# EAGLE design left_revision0_6 (EAGLE 7.2.0)
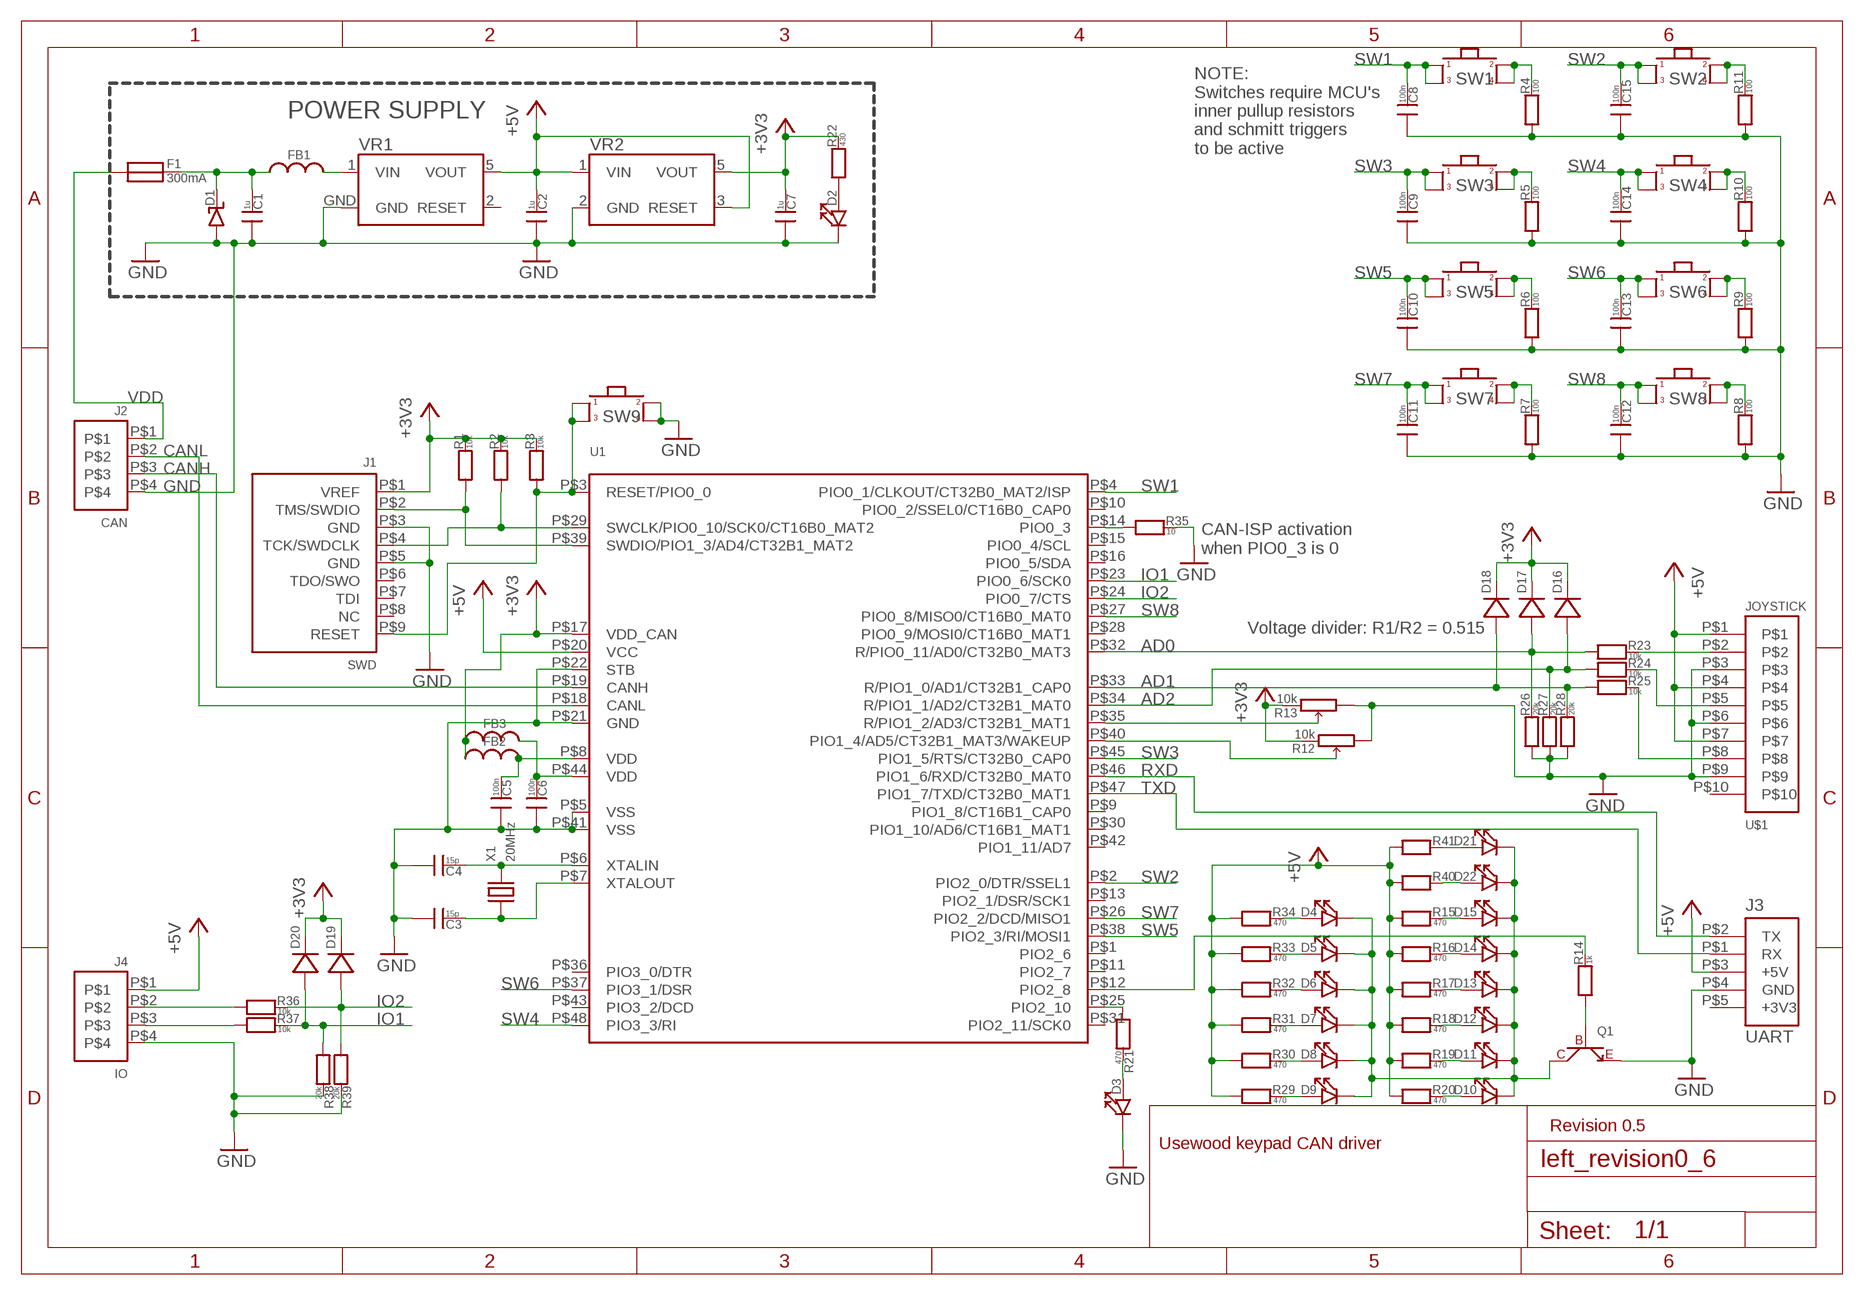
[diagram p0: schematic, sheet 1]

## Parts
C1  1u  CAP0603  [0603]
C2  1u  CAP0603  [0603]
C3  15p  CAP0603  [0603]
C4  15p  CAP0603  [0603]
C5  100n  CAP0603  [0603]
C6  100n  CAP0603  [0603]
C7  1u  CAP0603  [0603]
C8  100n  CAP0603  [0603]
C9  100n  CAP0603  [0603]
C10  100n  CAP0603  [0603]
C11  100n  CAP0603  [0603]
C12  100n  CAP0603  [0603]
C13  100n  CAP0603  [0603]
C14  100n  CAP0603  [0603]
C15  100n  CAP0603  [0603]
D1  DIODE_TVSDO-214AA  [DO-214AB]
D2  LED0603  [0603]
D3  LED0603  [0603]
D4  LED0603  [0603]
D5  LED0603  [0603]
D6  LED0603  [0603]
D7  LED0603  [0603]
D8  LED0603  [0603]
D9  LED0603  [0603]
D10  LED0603  [0603]
D11  LED0603  [0603]
D12  LED0603  [0603]
D13  LED0603  [0603]
D14  LED0603  [0603]
D15  LED0603  [0603]
D16  DIODEDO219AB  [DO219AB]
D17  DIODEDO219AB  [DO219AB]
D18  DIODEDO219AB  [DO219AB]
D19  DIODEDO219AB  [DO219AB]
D20  DIODEDO219AB  [DO219AB]
D21  LED0603  [0603]
D22  LED0603  [0603]
F1  300mA  FUSE100MA  [FUSE_100MA]
FB1  FERRITE0603  [0603]
FB2  FERRITE0603  [0603]
FB3  FERRITE0603  [0603]
J1  SWD  ARM_JTAG/SWD_HEADER_10_PINSMD  [ARM_10_PIN_JTAG/SWD_CONNECTOR]
J2  CAN  MOLEX_MICRO-FIT_4WAYTH  [MOLEX_MICRO-FIT_4WAY]
J3  UART  HEADER_USARTTH  [HEADER5_1]
J4  IO  MOLEX_MICRO-FIT_4WAYTH  [MOLEX_MICRO-FIT_4WAY]
Q1  NPN_TRANSISTORSOT323  [SOT323]
R1  10k  RES0603  [0603]
R2  10k  RES0603  [0603]
R3  10k  RES0603  [0603]
R4  100  RES0603  [0603]
R5  100  RES0603  [0603]
R6  100  RES0603  [0603]
R7  100  RES0603  [0603]
R8  100  RES0603  [0603]
R9  100  RES0603  [0603]
R10  100  RES0603  [0603]
R11  100  RES0603  [0603]
R12  10k  RES_POTRK09K1130C94  [RES_POT_RK09K1130C94]
R13  10k  RES_POTRK09K1130C94  [RES_POT_RK09K1130C94]
R14  1k  RES0603  [0603]
R15  470  RES0603  [0603]
R16  470  RES0603  [0603]
R17  470  RES0603  [0603]
R18  470  RES0603  [0603]
R19  470  RES0603  [0603]
R20  470  RES0603  [0603]
R21  470  RES0603  [0603]
R22  430  RES0603  [0603]
R23  10k  RES0603  [0603]
R24  10k  RES0603  [0603]
R25  10k  RES0603  [0603]
R26  20k  RES0603  [0603]
R27  20k  RES0603  [0603]
R28  20k  RES0603  [0603]
R29  470  RES0603  [0603]
R30  470  RES0603  [0603]
R31  470  RES0603  [0603]
R32  470  RES0603  [0603]
R33  470  RES0603  [0603]
R34  470  RES0603  [0603]
R35  10  RES0603  [0603]
R36  10k  RES0603  [0603]
R37  10k  RES0603  [0603]
R38  20k  RES0603  [0603]
R39  20k  RES0603  [0603]
R40  RES0603  [0603]
R41  RES0603  [0603]
SW1  SWITCH12X12MM_CENTER_HOLE  [SWITCH_12X12MM_CENTER_HOLE]
SW2  SWITCH12X12MM_CENTER_HOLE  [SWITCH_12X12MM_CENTER_HOLE]
SW3  SWITCH12X12MM_CENTER_HOLE  [SWITCH_12X12MM_CENTER_HOLE]
SW4  SWITCH12X12MM_CENTER_HOLE  [SWITCH_12X12MM_CENTER_HOLE]
SW5  SWITCH12X12MM_CENTER_HOLE  [SWITCH_12X12MM_CENTER_HOLE]
SW6  SWITCH12X12MM_CENTER_HOLE  [SWITCH_12X12MM_CENTER_HOLE]
SW7  SWITCH12X12MM_CENTER_HOLE  [SWITCH_12X12MM_CENTER_HOLE]
SW8  SWITCH12X12MM_CENTER_HOLE  [SWITCH_12X12MM_CENTER_HOLE]
SW9  SWITCHREGULAR  [SWITCH_REGULAR]
U1  LPC11C22QFP48  [QFP48]
U$1  JOYSTICK  MOLEX_MICRO-FIT_10WAYTH  [MOLEX-MICRO-FIT_10WAY]
VR1  NCV8675175AA  [175AA]
VR2  LP2985SOP5  [SOP5]
X1  20MHz  XTALSMD_5X3.2  [XTAL_SMD_5X3.2]

## Nets
+3V3: C7.1 D16.P$2(N) D17.P$2(N) D18.P$2(N) D19.P$2(N) D20.P$2(N) FB2.0 FB3.0 J1.P$1(VREF) R1.1 R2.1 R3.1 R12.P$3 R13.P$3 R22.1 U1.P$17(VDD_CAN) VR2.5(VOUT)
+5V: C2.1 J3.P$3(+5V) J4.P$1 R15.0 R16.0 R17.0 R18.0 R19.0 R20.0 R29.0 R30.0 R31.0 R32.0 R33.0 R34.0 R40.0 R41.0 U1.P$20(VCC) U$1.P$1 U$1.P$4 U$1.P$7 VR1.5(VOUT) VR2.1(VIN) VR2.3(RESET)
AD0: D17.P$1(P) R23.0 R26.1 U1.P$32(R/PIO0_11/AD0/CT32B0_MAT3)
AD1: D18.P$1(P) R25.0 R28.1 U1.P$33(R/PIO1_0/AD1/CT32B1_CAP0)
AD2: D16.P$1(P) R24.0 R27.1 U1.P$34(R/PIO1_1/AD2/CT32B1_MAT0)
CAN_ISP: R35.0 U1.P$14(PIO0_3)
CANH: J2.P$3 U1.P$19(CANH)
CANL: J2.P$2 U1.P$18(CANL)
GND: C1.0 C2.0 C3.0 C4.0 C5.0 C6.0 C7.0 C8.0 C9.0 C10.0 C11.0 C12.0 C13.0 C14.0 C15.0 D1.P$1(P) D2.1 D3.1 J1.P$3(GND) J1.P$5(GND) J2.P$4 J3.P$4(GND) J4.P$4 Q1.R(E) R4.0 R5.0 R6.0 R7.0 R8.0 R9.0 R10.0 R11.0 R12.P$1 R13.P$1 R26.0 R27.0 R28.0 R35.1 R38.1 R39.1 SW9.P$3 SW9.P$4 U1.P$5(VSS) U1.P$21(GND) U1.P$22(STB) U1.P$41(VSS) U$1.P$3 U$1.P$6 U$1.P$9 VR1.GND VR2.2(GND)
IO1: D20.P$1(P) R37.1 R38.0 U1.P$23(PIO0_6/SCK0)
IO2: D19.P$1(P) R36.1 R39.0 U1.P$24(PIO0_7/CTS)
LED3: D3.0 R21.1
LED4: D4.0 R34.1
LED5: D5.0 R33.1
LED6: D6.0 R32.1
LED7: D7.0 R31.1
LED8: D8.0 R30.1
LED9: D9.0 R29.1
N$1: C1.1 D1.P$2(N) F1.P$2 FB1.0
N$2: C6.1 FB3.1 U1.P$44(VDD)
N$3: D2.0 R22.0
N$4: FB1.1 VR1.1(VIN)
N$5: R14.1 U1.P$12(PIO2_8)
N$6: R21.0 U1.P$25(PIO2_10)
N$12: R4.1 SW1.P$3 SW1.P$4
N$13: R5.1 SW3.P$3 SW3.P$4
N$14: R6.1 SW5.P$3 SW5.P$4
N$15: R11.1 SW2.P$3 SW2.P$4
N$16: R9.1 SW6.P$3 SW6.P$4
N$17: R10.1 SW4.P$3 SW4.P$4
N$18: R8.1 SW8.P$3 SW8.P$4
N$19: R7.1 SW7.P$3 SW7.P$4
N$20: D15.0 R15.1
N$21: D14.0 R16.1
N$22: D13.0 R17.1
N$23: D12.0 R18.1
N$24: D11.0 R19.1
N$25: D10.0 R20.1
N$26: C5.1 FB2.1 U1.P$8(VDD)
N$27: J4.P$2 R36.0
N$28: J4.P$3 R37.0
N$29: D21.0 R41.1
N$30: D22.0 R40.1
N$31: D4.1 D5.1 D6.1 D7.1 D8.1 D9.1 D10.1 D11.1 D12.1 D13.1 D14.1 D15.1 D21.1 D22.1 Q1.M(C)
PIO1_2: R12.P$2 U1.P$40(PIO1_4/AD5/CT32B1_MAT3/WAKEUP)
PIO1_4: R13.P$2 U1.P$35(R/PIO1_2/AD3/CT32B1_MAT1)
Q1: Q1.L(B) R14.0
RESET: J1.P$9(RESET) R3.0 SW9.P$1 SW9.P$2 U1.P$3(RESET/PIO0_0)
RXD: J3.P$2(TX) U1.P$46(PIO1_6/RXD/CT32B0_MAT0)
SW1: C8.1 SW1.P$1 SW1.P$2 U1.P$4(PIO0_1/CLKOUT/CT32B0_MAT2/ISP)
SW2: C15.1 SW2.P$1 SW2.P$2 U1.P$2(PIO2_0/DTR/SSEL1)
SW3: C9.1 SW3.P$1 SW3.P$2 U1.P$45(PIO1_5/RTS/CT32B0_CAP0)
SW4: C14.1 SW4.P$1 SW4.P$2 U1.P$48(PIO3_3/RI)
SW5: C10.1 SW5.P$1 SW5.P$2 U1.P$38(PIO2_3/RI/MOSI1)
SW6: C13.1 SW6.P$1 SW6.P$2 U1.P$37(PIO3_1/DSR)
SW7: C11.1 SW7.P$1 SW7.P$2 U1.P$26(PIO2_2/DCD/MISO1)
SW8: C12.1 SW8.P$1 SW8.P$2 U1.P$27(PIO0_8/MISO0/CT16B0_MAT0)
SWDCLK: J1.P$4(TCK/SWDCLK) R2.0 U1.P$29(SWCLK/PIO0_10/SCK0/CT16B0_MAT2)
SWDIO: J1.P$2(TMS/SWDIO) R1.0 U1.P$39(SWDIO/PIO1_3/AD4/CT32B1_MAT2)
TXD: J3.P$1(RX) U1.P$47(PIO1_7/TXD/CT32B0_MAT1)
VDD: F1.P$1 J2.P$1
XJOY: R23.1 U$1.P$2
XTALIN: C4.1 U1.P$6(XTALIN) X1.P$2
XTALOUT: C3.1 U1.P$7(XTALOUT) X1.P$1
YJOY: R24.1 U$1.P$5
ZJOY: R25.1 U$1.P$8
Unconnected: J1.P$6(TDO/SWO) J1.P$7(TDI) J1.P$8(NC) J3.P$5(+3V3) U1.P$1(PIO2_6) U1.P$9(PIO1_8/CT16B1_CAP0) U1.P$10(PIO0_2/SSEL0/CT16B0_CAP0) U1.P$11(PIO2_7) U1.P$13(PIO2_1/DSR/SCK1) U1.P$15(PIO0_4/SCL) U1.P$16(PIO0_5/SDA) U1.P$28(PIO0_9/MOSI0/CT16B0_MAT1) U1.P$30(PIO1_10/AD6/CT16B1_MAT1) U1.P$31(PIO2_11/SCK0) U1.P$36(PIO3_0/DTR) U1.P$42(PIO1_11/AD7) U1.P$43(PIO3_2/DCD) U$1.P$10 VR1.2(RESET)

## Notes on the sheet
- POWER SUPPLY
- NOTE:
  Switches require MCU's
  inner pullup resistors
  and schmitt triggers
  to be active
- CAN-ISP activation 
  when PIO0_3 is 0
- Voltage divider: R1/R2 = 0.515
- Revision 0.5
- Usewood keypad CAN driver

## Library data of the parts
C1-C15 = arm:CAP
D1 = arm:DIODE_TVS
D2-D15 D21 D22 = arm:LED
D16-D20 = usevolt:DIODE
F1 = arm:FUSE
FB1-FB3 = arm:FERRITE
J1 = arm:ARM_JTAG/SWD_HEADER_10_PIN: ARM Olimex Debugger 10 pin header, 0.05 inch
J2 J4 = arm:MOLEX_MICRO-FIT_4WAY: MOLEX 43045-0401 HEADER, RIGHT ANGLE, DUAL ROW, 4 WAY, 1704306
J3 = arm:HEADER_USART: USB to USART module header
Q1 = usevolt:NPN_TRANSISTOR: http://www.farnell.com/datasheets/1697409.pdf 9294511
R1-R11 R14-R41 = arm:RES
R12 R13 = usevolt:RES_POT
SW1-SW9 = arm:SWITCH
U1 = arm:LPC11C22: NXP MCU, 32BIT, CORTEX-M0, 50MHZ, LQFP-48, 2314753
U$1 = usevolt:MOLEX_MICRO-FIT_10WAY: MOLEX HEADER, MICRO-FIT, R/A, DUAL ROW, 10 WAY, 1012255
VR1 = arm:NCV8675: ON SEMICONDUCTOR NCV8675DT50RKG LDO, 350MA, 5V, 5DPAK, 1885151
VR2 = arm:LP2985: TEXAS INSTRUMENTS LP2985IM5-3.3 V REG LDO +3.3V, SMD, 2985, SOT235
X1 = arm:XTAL

## Board
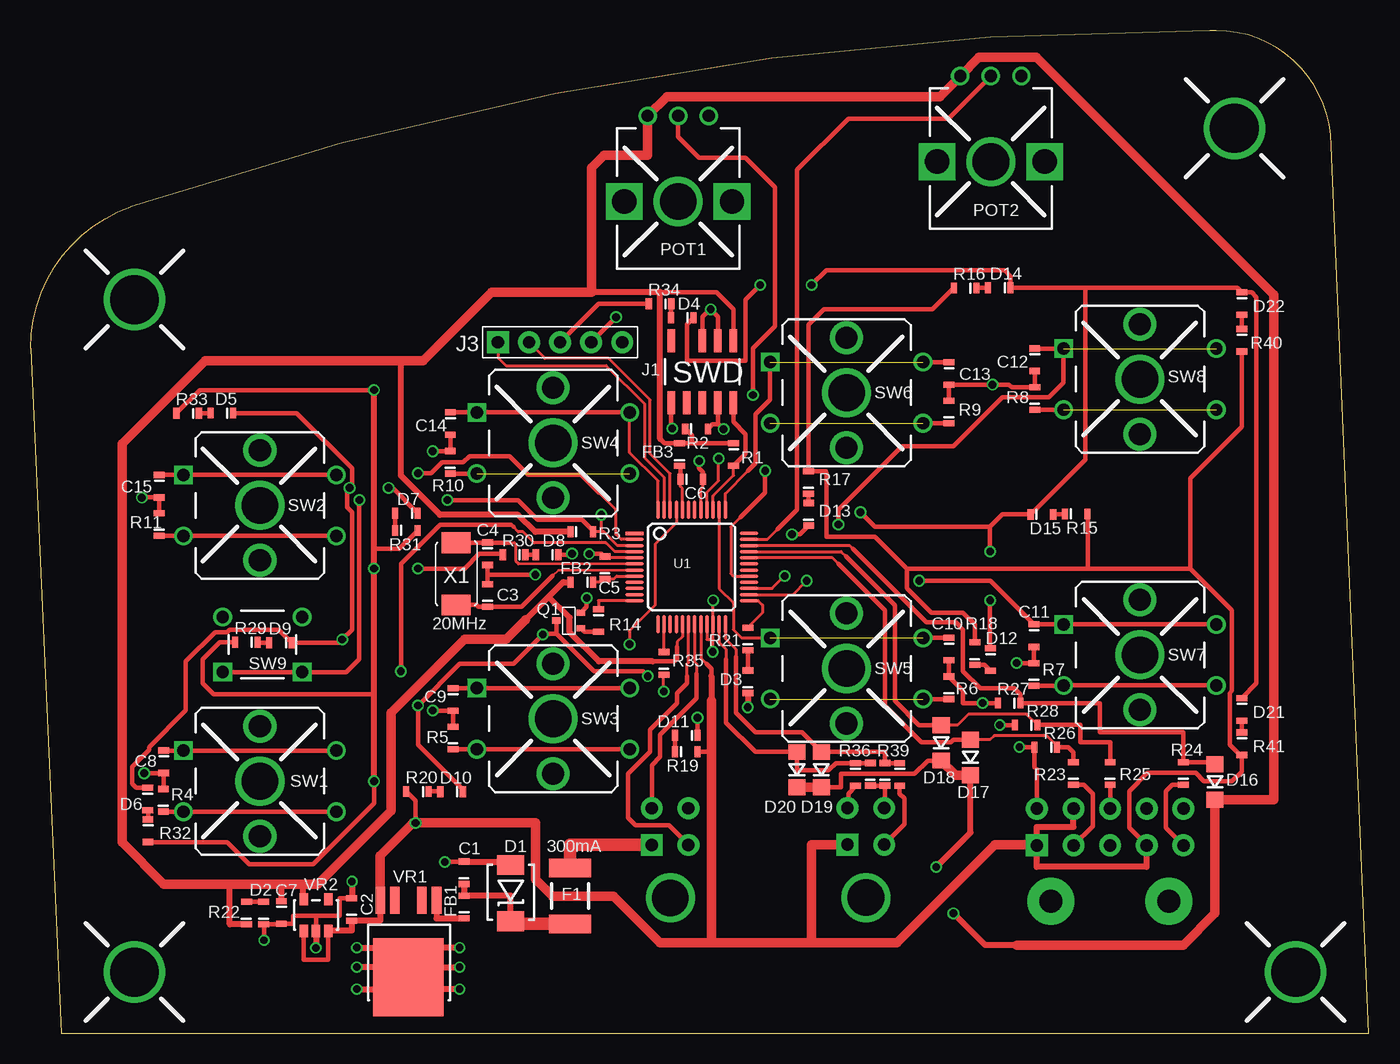
[diagram p1: board, top side]
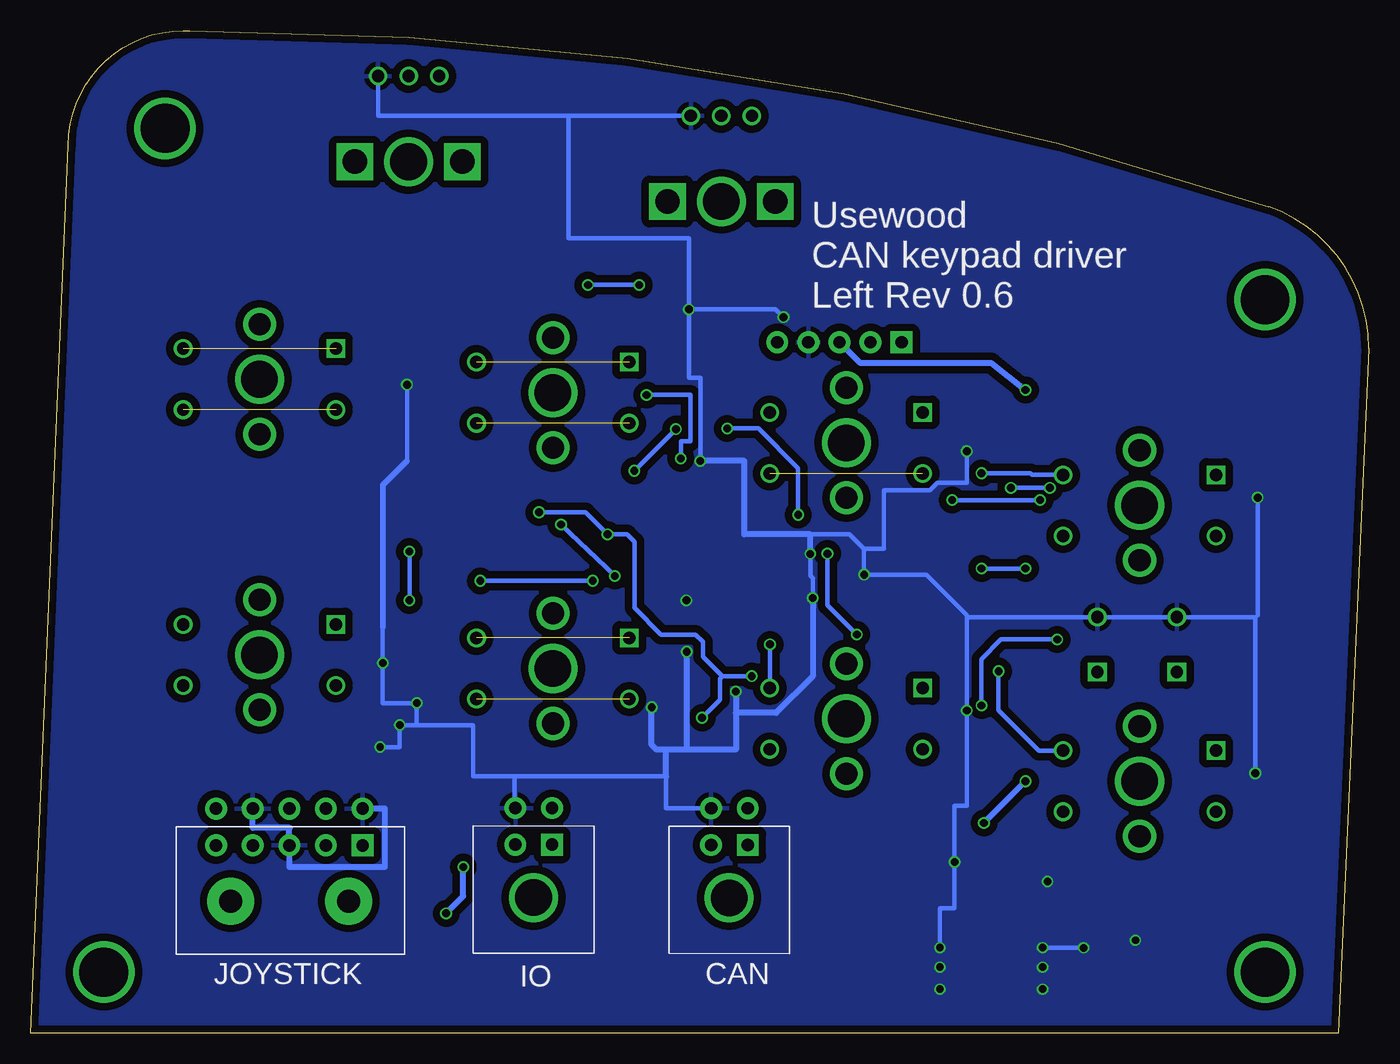
[diagram p2: board, bottom side, seen from below]

Size 109.5 x 82 mm. Coordinates in mm from the lower left corner, seen from the top.
Outline: 109.5,0 106.4,72.6 arc90 97,82 96.5,82 arc19 8.2,67.6 arc71 0,56 2.5,0 109.5,0
Copper layers (1*16): Top 0.035mm / dielectric 1.5mm / Bottom 0.035mm
Design rules "SeeedStudio_2layer_DRU_no_angle_20140221 *": minimum track width 6mil, minimum drill 12mil, track to track 6mil, track to pad 6mil, pad to pad 6mil, via to via 6mil, smd to smd 0mil, copper to edge 10mil, drill to drill 10mil, minimum pad ring 10mil, minimum via ring 6mil, stop-mask expansion 2mil, vias tented up to drill 100mil, thermal gap 16mil

### Footprints (pad centres in the part's own frame; a part is rotated, then mirrored left to right if it is on the bottom)
0603 = smd 0.508 x 0.889: 0 -1.041,0; 1 0.8,0
DO-214AB = smd 1.62 x 2.18: P$1 0,0; P$2 4.6,0
DO219AB = smd 1.3 x 1.4: P$1 0,0; P$2 2.9,0
FUSE_100MA = smd 1.5 x 3.41: P$1 0,0; P$2 4.572,0
ARM_10_PIN_JTAG/SWD_CONNECTOR = smd 1.905 x 0.635: P$1 -1.27,0; P$2 3.81,0; P$3 -1.27,-1.27; P$4 3.81,-1.27; P$5 -1.27,-2.54; P$6 3.81,-2.54; P$7 3.81,-3.81; P$8 -1.27,-5.08; P$9 3.81,-5.08
MOLEX_MICRO-FIT_4WAY = drill 1.016 pad 1.778 square: P$1 1.27,2.032 | drill 1.016 pad 1.778: P$2 -1.727,2.032; P$3 1.27,5.029; P$4 -1.727,5.029 | drill 3: P$5 -0.25,-2.3
HEADER5_1 = drill 1.016 pad 1.778 square: P$1 0,0 | drill 1.016 pad 1.778: P$2 0,-2.54; P$3 0,-5.08; P$4 0,-7.62; P$5 0,-10.16
SOT323 = smd 0.5 x 0.7: L 0,0; M 0.63,2; R 1.27,0
RES_POT_RK09K1130C94 = drill 1: P$1 -2.5,0; P$2 0,0; P$3 2.5,0 | drill 2 square: P$4 -4.4,7; P$5 4.4,7 | drill 3 pad 2.9: P$6 0,7
SWITCH_12X12MM_CENTER_HOLE = drill 1.016 square: P$1 -3,4.75 | drill 1.016: P$2 9.5,4.75; P$3 -3,-0.25; P$4 9.5,-0.25 | drill 3 pad 2.9: P$5 3.25,2.25 | drill 1.8 pad 1.7: P$10 3.25,6.75; P$11 3.25,-2.25
SWITCH_REGULAR = drill 1.016 square: P$1 0,0; P$2 6.5,0 | drill 1.016: P$3 6.5,4.5; P$4 0,4.5
QFP48 = smd 1.5 x 0.28: P$1 0.2,0; P$2 0.2,-0.5; P$3 0.2,-1; P$4 0.2,-1.5; P$5 0.2,-2; P$6 0.2,-2.5; P$7 0.2,-3; P$8 0.2,-3.5; P$9 0.2,-4; P$10 0.2,-4.5; P$11 0.2,-5; P$12 0.2,-5.5; P$25 9.55,-5.5; P$26 9.55,-5; P$27 9.55,-4.5; P$28 9.55,-4; P$29 9.55,-3.5; P$30 9.55,-3; P$31 9.55,-2.5; P$32 9.55,-2; P$33 9.55,-1.5; P$34 9.55,-1; P$35 9.55,-0.5; P$36 9.55,0 | smd 0.28 x 1.5: P$13 2.125,-7.425; P$14 2.625,-7.425; P$15 3.125,-7.425; P$16 3.625,-7.425; P$17 4.125,-7.425; P$18 4.625,-7.425; P$19 5.125,-7.425; P$20 5.625,-7.425; P$21 6.125,-7.425; P$22 6.625,-7.425; P$23 7.125,-7.425; P$24 7.625,-7.425; P$37 7.625,1.925; P$38 7.125,1.925; P$39 6.625,1.925; P$40 6.125,1.925; P$41 5.625,1.925; P$42 5.125,1.925; P$43 4.625,1.925; P$44 4.125,1.925; P$45 3.625,1.925; P$46 3.125,1.925; P$47 2.625,1.925; P$48 2.125,1.925
MOLEX-MICRO-FIT_10WAY = drill 1.016 pad 1.778 square: P$1 0,-0.508 | drill 1.016 pad 1.778: P$2 -2.997,-0.508; P$3 -5.994,-0.508; P$4 -8.992,-0.508; P$5 -11.989,-0.508; P$6 0,2.489; P$7 -2.997,2.489; P$8 -5.994,2.489; P$9 -8.992,2.489; P$10 -11.989,2.489 | drill 1.905 pad 3.81: P$11 -10.795,-5.08; P$12 -1.143,-5.08
175AA = smd 2.2 x 0.8: 1 0,-2.2; 2 0,-1; 4 0,1.2; 5 0,2.4 | smd 6.4 x 5.8: GND -6.3,0.1
SOP5 = smd 0.7 x 1: 1 -1,0; 2 0,0; 3 1,0; 4 1,2.6; 5 -1,2.6
XTAL_SMD_5X3.2 = smd 1.7 x 2.4: P$1 -2.54,0; P$2 2.54,0

### Placement (x,y rotation side)
C1  35.47,13 270 top
C2  26.27,10 270 top
C3  37.4,35.67 270 top
C4  37.39,39.33 90 top
C5  46.99,37.95 270 top
C6  53.97,45.3 180 top
C7  20.52,10 90 top
C8  10.9,22.31 90 top
C9  34.57,27.41 90 top
C10  75.14,31.53 90 top
C11  82.1,32.63 90 top
C12  82.15,55.19 90 top
C13  75.15,54.07 90 top
C14  34.34,49.97 90 top
C15  10.53,44.85 90 top
D1  39.28,13.76 270 top
D2  19.07,9.7 270 top
D3  58.69,28.63 270 top
D4  53.43,58.51 0 top
D5  15.77,50.72 0 top
D6  9.58,19.27 90 top
D7  30.87,42.53 0 top
D8  42.37,39.14 0 top
D9  20.57,31.94 0 top
D10  34.57,19.75 0 top
D11  53.77,24.35 0 top
D12  78.54,30.67 90 top
D13  63.67,42.33 270 top
D14  79.37,60.97 0 top
D15  82.63,42.42 180 top
D16  96.9,22 270 top
D17  76.9,24 270 top
D18  74.5,25.2 270 top
D19  64.7,23 270 top
D20  62.7,23 270 top
D21  99.1,26.6 90 top
D22  99.1,59.8 90 top
F1  44.13,13.51 270 top
FB1  35.48,10.2 270 top
FB2  45.23,36.88 0 top
FB3  53.1,47.2 270 top
J1  57.5,55.36 270 top
J2  52.1,13.37 0 bottom
J3  38.24,56.51 90 top
J4  68.1,13.39 0 bottom
Q1  45.03,33.12 90 top
R1  57.52,47.45 90 top
R2  54.37,49.42 180 top
R3  44.97,41.01 180 top
R4  10.87,18.93 270 top
R5  34.56,24.03 270 top
R6  75.14,28.13 270 top
R7  82.09,29.23 270 top
R8  82.16,51.79 270 top
R9  75.14,50.69 270 top
R10  34.35,46.57 270 top
R11  10.53,41.49 270 top
R12  52.99,75.02 180 top
R13  78.57,78.28 180 top
R14  46.47,33.87 90 top
R15  85.43,42.46 180 top
R16  76.57,60.95 0 top
R17  63.65,44.93 270 top
R18  77.26,30.93 270 top
R19  53.53,23.02 180 top
R20  31.77,19.77 0 top
R21  58.68,32.13 270 top
R22  17.67,9.7 270 top
R23  85.32,21.13 270 top
R24  94.32,21.13 270 top
R25  88.33,21.13 270 top
R26  83.17,23.4 0 top
R27  80.17,27 0 top
R28  81.57,25.21 0 top
R29  17.77,31.98 0 top
R30  39.67,39.14 0 top
R31  30.63,41.11 180 top
R32  9.61,16.67 90 top
R33  12.97,50.7 0 top
R34  51.61,59.65 0 top
R35  51.82,30.13 270 top
R36  71.1,21.29 90 top
R37  67.48,21.29 90 top
R38  68.71,21.05 270 top
R39  69.91,21.05 270 top
R40  99.1,56.8 90 top
R41  99.1,23.8 90 top
SW1  15.51,18.36 0 top
SW2  15.51,40.92 0 top
SW3  39.51,23.47 0 top
SW4  39.51,46.02 0 top
SW5  63.51,27.58 0 top
SW6  63.51,50.13 0 top
SW7  87.51,28.69 0 top
SW8  87.51,51.24 0 top
SW9  15.72,29.53 0 top
U1  49.21,40.88 0 top
U$1  82.33,15.87 0 bottom
VR1  31.01,10.87 90 top
VR2  23.35,8.36 0 top
X1  34.82,37.56 90 top

### Tracks (layer width: path | path; a pad name or v marks a point on that pad's centre or on a via)
+3V3  (via drill 0.64)
  Top 0.254: U1.P$17 53.34,32.44 52.9,32 52.9,31.6
  Top 0.381: 52.9,31.6 52.9,30.6 52.7,30.4 50.9,30.4 | J1.P$1 57.5,59.2 56.1,60.6 51.5,60.6 | 51.5,48.6 51.86,48.24 FB3.0 54.1,48.24 | D20.P$2 66.3,20.1 66.3,21.2 72.3,21.2 73.4,22.3 D18.P$2 | R1.1 56.52,48.24 54.1,48.24 | R3.1 | R2.1 54.1,48.89 54.1,48.24
  Top 0.508: R22.1 16.3,8.9 16.3,12.2 | 20.52,12.2 C7.1 | VR2.5 22.3,10.96 22.3,12.2 | 40.5,33.8 42.4,35.7 | 42.4,35.7 43.58,36.88 FB2.0 | 50.9,30.4 46.5,30.4 44.1,32.8 44.1,34 42.4,35.7 | 45.9,60.6 51.5,60.6 51.5,48.6 | 80.7,7.2 78.1,7.2 v75.5,9.8 | v74.1,13.6 76.9,16.4 D17.P$2 | R3.1 41.3,41 39.9,42.4 33.5,42.4 30.3,45.6 30.3,55
  Top 0.762: 40.5,33.8 38.9,32.2 35.5,32.2 29.5,26.2 29.5,18.2 23.5,12.2 22.3,12.2 20.52,12.2 16.3,12.2 10.9,12.2 7.5,15.6 7.5,48.2 14.3,55 30.3,55 32.1,55 37.7,60.6 45.9,60.6 45.9,70.8 46.9,71.8 50.49,71.8 R12.P$3 52.06,76.6 74.39,76.6 R13.P$3 77.59,79.8 82.3,79.8 101.7,60.4 101.7,19.1 D16.P$2 96.9,9.8 94.3,7.2 80.7,7.2 | D18.P$2 75.7,21.1 D17.P$2 | D20.P$2 D19.P$2
  Bottom 0.508: v75.5,9.8 74.1,11.2 v74.1,13.6
+5V  (via drill 0.64)
  Top 0.254: U1.P$20 54.84,30.66 55.3,30.2
  Top 0.381: VR2.3 24.35,6 22.35,6 VR2.1 | 91.3,15.37 U$1.P$4 89.9,16.79 89.9,19.8 91.38,21.28 95.32,21.28 96,20.6 98.3,20.6 99.1,21.4 99.1,22.6 | 55.3,30.2 55.7,29.8 55.7,29.2 | R32.0 16.07,15.63 17.9,13.8 23.1,13.8 28.1,18.8 v28.1,20.6 | R29.0 15.48,31.98 14.1,30.6 14.1,28.6 15,27.7 27.9,27.7 28.1,27.8 | R19.0 54.7,23 55.7,23 | R20.0 31.5,19 v31.5,17.2 | R30.0 38.58,39.2 36.7,39.2 35.5,38 v31.7,38 | R31.0 30.16,39.6 28.1,39.6 | R33.0 13.83,52.6 v28.1,52.6 | 99.1,22.6 R41.0 | 99.1,22.6 98.1,23.6 98.1,27.8 98.3,28 98.3,34.6 94.9,38 | R40.0 99.1,49.6 94.9,45.4 94.9,38 | 94.9,38 86.5,38 | 86.5,38 71.7,38 | 71.7,38 71.7,36.4 73.7,34.4 76.3,34.4 77.26,33.44 R18.0 | 71.7,38 69.1,40.6 65.1,40.6 65.1,45.8 65.07,45.97 R17.0 63.65,57.95 64.9,59.2 73.79,59.2 R16.0 | R15.0 86.5,42.43 86.5,38 | R34.0 46.46,59.65 J3.P$3
  Top 0.508: VR1.5 28.61,9.2 C2.1 26.3,9.2 26.3,8.4 24.35,8.4 VR2.3 | U$1.P$7 85.33,16.88 82.33,16.88 U$1.P$1 82.33,13.6 91.3,13.6 91.3,15.37 | v28.1,20.6 28.1,27.8 v28.1,38 28.1,39.6 v28.1,52.6 | 55.7,29.2 55.7,27.2
  Top 0.762: VR1.5 28.61,14.51 31.3,17.2 v31.5,17.2 41.3,17.2 41.3,12.6 42.7,11.2 47.7,11.2 51.5,7.4 55.7,7.4 | 55.7,7.4 63.9,7.4 | 63.9,7.4 70.9,7.4 78.9,15.4 82.3,15.4 U$1.P$1 | J4.P$1 63.9,15.42 63.9,7.4 | 55.7,27.2 55.7,23 55.7,7.4
  Bottom 0.381: v31.7,38 v28.1,38
  Bottom 0.508: v31.5,17.2 v28.1,20.6 | v28.1,52.6 30.9,54.8 41.61,54.8 J3.P$3
AD0
  Top 0.254: R26.1 83.97,23.51 83.14,24.34 78.84,24.34 78.5,24 D17.P$1 | 66.1,38.4 65.62,38.88 U1.P$32
  Top 0.381: R23.0 85.32,22.98 84.9,23.4 R26.1 | D17.P$1 75.5,24 75.3,23.8 72.9,23.8 69.9,26.8 69.9,34.6 66.1,38.4
AD1
  Top 0.254: R28.1 81.48,26.1 76.74,26.1 75.84,25.2 D18.P$1 | U1.P$33 66.32,39.38 66.7,39
  Top 0.381: R25.0 88.33,23.8 85.9,23.8 85.9,25.21 R28.1 | D18.P$1 72.7,25.2 70.7,27.2 70.7,35 66.7,39
AD2
  Top 0.254: 67.3,39.6 67.02,39.88 U1.P$34
  Top 0.381: D16.P$1 96.73,22.17 R24.0 94.32,24.6 87.5,24.6 87.5,27 R27.1 80.97,27.73 80.5,28.2 77.7,28.2 76.3,29.6 76.3,33 75.7,33.6 73.3,33.6 67.3,39.6
CAN_ISP
  Top 0.254: R35.0 51.84,31.19 U1.P$14
CANH
  Top 0.254: U1.P$19 54.34,30.36 54.5,30.2 54.5,29.4
  Top 0.381: 54.5,29.4 54.5,27.4 51.5,24.4 51.5,22.6 50.83,21.93 J2.P$3
CANL
  Top 0.254: 53.7,29.2 53.7,30.2 53.84,30.34 U1.P$18
  Top 0.381: J2.P$2 52.22,17 49.5,17 48.9,17.6 48.9,21.2 50.7,23 50.7,24.8 52.9,27 52.9,27.8 53.7,28.6 53.7,29.2
GND  (via drill 0.61, 0.64)
  Top 0.254: U1.P$5 47.23,38.88 C5.0 | U1.P$41 54.84,44.54 55.01,44.71 C6.0 | v55.82,31.2 55.84,31.22 55.84,32.18 | U1.P$21 55.34,32.2 55.84,32.2 55.84,32.18 | v51.8,27.94 51.8,29.33 R35.1 | U1.P$22 55.84,35.34 v55.84,35.4 | 55.84,33.42 55.84,32.18
  Top 0.381: 23.35,9.6 21.5,9.6 21.5,8.96 C7.0 20.52,8.9 D2.1 19.1,8.9 v19.1,7.6 | 23.35,9.6 VR2.2 | C2.0 25.3,11.04 25.3,9.6 23.35,9.6 | C5.0 46.71,39.19 v45.7,39.2 | R4.0 10.9,19.99 C8.0 9.3,21.27 v9.3,21.26 | R11.0 C15.0 9.1,43.81 v9.1,43.8 | C14.0 R10.0 v32.9,47.61 v32.9,47.6 | R5.0 34.56,26.36 C9.0 32.9,26.37 v32.9,26.4 | R9.0 C13.0 | C13.0 | C12.0 R8.0 80.27,52.83 80.06,53.04 v78.7,53.04 v78.7,53.03 C13.0 | C10.0 R6.0 75.14,29.16 76.3,28 76.3,27 v77.9,27 R27.0 | C11.0 R7.0 80.77,30.27 v80.68,30.28 | U$1.P$6 82.33,21.57 82.13,21.77 R26.0 v80.9,23.4 | R28.0 v79.3,25.2 | J4.P$4 69.91,18.5 R39.1 R38.1 | v33.9,14 33.9,14.04 C1.0 | J1.P$3 56.23,58.6 v55.64,59.2 54.96,58.6 J1.P$5 | C6.0 55.01,45.89 54.7,46.2 v54.7,46.8 | C3.0 37.4,37.5 | 37.4,37.5 37.4,38.28 C4.0 | v41.3,37.5 37.4,37.5 | J3.P$4 47.9,58.55 v47.9,58.56 | Q1.R 45.5,34.86 v45.5,35.6
  Top 0.508: C1.0 39.28,14.04 D1.P$1 | v26.3,12.4 26.3,11.04 C2.0 | v26.7,7 29.3,7 29.3,4.57 VR1.GND 30.91,5.2 | 30.91,5.2 30.91,5.4 | 30.91,5.4 v26.7,5.4 | v26.7,3.6 30.9,3.6 | 30.9,3.6 30.9,5.2 30.91,5.2 | 31.1,5.4 v35.1,5.4 | v35.1,3.6 30.9,3.6 | v35.1,7 31.1,7 31.1,5.4 | 31.1,5.4 30.91,5.4 | VR2.2 23.35,7 v23.34,6.98 | D3.1 58.68,27.82 v58.68,26.66
  Bottom 0.381: v23.34,6.98 23.34,7 v26.7,7 | 77.9,25.2 v77.9,27 80.68,27 v80.68,30.28 80.68,33.2 80.68,34.4 | 77.9,25.2 v79.3,25.2 79.3,23.4 v80.9,23.4 | 69.9,21 57.5,21 57.5,18.4 J2.P$4 | 69.9,21 69.9,18.41 J4.P$4 | v35.1,7 35.1,10.2 33.9,10.2 v33.9,14 33.9,18.6 32.9,18.6 v32.9,26.4 32.9,34.03 | 9.3,34 15.72,34 SW9.P$4 SW9.P$3 32.9,34.03 | 9.3,34 v9.3,21.26 | v9.1,43.8 9.1,34.2 9.3,34 | R13.P$1 81.07,75.02 65.5,75.02 | 65.5,75.02 R12.P$1 | 55.64,65 65.5,65 65.5,75.02 | v54.7,46.8 54.7,53.6 55.64,53.6 v55.64,59.2 | 55.63,65 55.64,65 | 55.64,65 v55.64,59.2 | 77.9,25.2 73.3,25.2 73.3,21 69.9,21 | 78.7,46.8 v78.7,53.04 | v45.5,35.6 45.5,37.2 45.7,37.4 v45.7,39.2 | v32.9,47.6 32.9,45 35.3,45 35.9,44.4 39.7,44.4 39.7,39.6 41.3,39.6 | v47.9,58.56 48.54,59.2 v55.64,59.2 | 41.3,39.6 v41.3,37.5 36.2,37.5 32.9,34.2 32.9,34.03 | 41.3,39.6 42.5,40.8 45.7,40.8
  Bottom 0.508: U$1.P$9 91.32,16.8 88.3,16.8 88.33,16.77 U$1.P$3 88.33,13.6 80.5,13.6 80.5,18.36 U$1.P$6 | v51.8,27.94 51.8,26.2 | 51.8,26.2 51.8,23.2 55.82,23.2 | 55.82,23.2 57.5,23.2 | 57.5,23.2 58.3,23.2 58.68,23.58 v58.68,26.66 | v55.82,31.2 55.82,23.2 | v45.7,39.2 45.7,40.8 51.1,40.8 51.1,46.8 v54.7,46.8 | 78.7,46.8 80.68,44.82 80.68,33.2 | v45.5,35.6 45.5,29.2 48.5,26.2 51.8,26.2 | 57.5,21 57.5,23.2
  pour Bottom (isolate 0.61): 2.5,0 0.1,56.4 arc-41 2.3,63.2 arc-28 7.5,67.2 arc-9 16.3,70.2 arc1 33.3,74.6 arc-5 50.1,78.2 arc-6 78.1,81.4 arc-3 94.9,82 arc-1 97.3,82 arc-15 98.7,81.8 arc-5 101.1,81 arc-27 103.7,79.2 arc-39 106.3,72.8 109.5,0
IO1
  Top 0.254: U1.P$23 56.34,31.96 56.9,31.4 56.9,30.6
  Top 0.381: R38.0 R37.1 65.89,22.09 65.3,21.5 62.7,21.5 D20.P$1 59.3,23 56.9,25.4 56.9,30.6
IO2
  Top 0.254: R36.1 | U1.P$24 56.84,32.26 57.7,31.4 57.7,30.8
  Top 0.381: R36.1 R39.0 69.9,22.11 69.9,23 D19.P$1 63.1,24.6 59.3,24.6 57.7,26.2 57.7,30.8
LED3
  Top 0.381: D3.0 58.69,30.72 R21.1
LED4
  Top 0.381: D4.0 52.41,58.53 R34.1
LED5
  Top 0.381: D5.0 13.77,50.72 R33.1
LED6
  Top 0.381: R32.1 9.61,18.2 D6.0
LED7
  Top 0.381: R31.1 D7.0
LED8
  Top 0.381: D8.0 R30.1
LED9
  Top 0.381: D9.0 18.61,31.94 R29.1
N$1
  Top 0.508: C1.1 35.48,12.2 FB1.0 39.28,11.24 D1.P$2
  Top 1.016: F1.P$2 39.28,8.94 D1.P$2
N$2
  Top 0.254: U1.P$44 53.34,44.56 53.17,44.73 C6.1
  Top 0.381: C6.1 53.17,46.33 FB3.1
N$3
  Top 0.381: R22.0 D2.0
N$4
  Top 0.508: VR1.1 33.21,9.4 FB1.1
N$5
  Top 0.254: U1.P$12 46.47,35.38 R14.1
N$6
  Top 0.254: U1.P$25 59.52,35.38 59.9,35 59.9,34.4 58.68,33.18 R21.0
N$7  (via drill 4)
  other vias: 103.5,5
N$8  (via drill 4)
  other vias: 8.5,5
N$9  (via drill 4)
  other vias: 8.5,60
N$10  (via drill 4)
  other vias: 98.5,74
N$12
  Top 0.381: R4.1 10.89,18.11 SW1.P$3 SW1.P$4
N$13
  Top 0.381: R5.1 SW3.P$3 SW3.P$4
N$14  (1 unrouted)
  Top 0.381: R6.1 SW5.P$4
N$15
  Top 0.381: R11.1 10.55,40.67 SW2.P$3 SW2.P$4
N$16  (1 unrouted)
  Top 0.381: SW6.P$4 R9.1
N$17  (1 unrouted)
  Top 0.381: SW4.P$3 R10.1
N$18  (1 unrouted)
  Top 0.381: R8.1 SW8.P$3
N$19
  Top 0.381: R7.1 84.5,28.43 SW7.P$3 SW7.P$4
N$20
  Top 0.381: D15.0 83.7,42.46 R15.1
N$21
  Top 0.381: D14.0 78.31,60.95 R16.1
N$22
  Top 0.381: D13.0 63.65,43.38 R17.1
N$23
  Top 0.381: D12.0 78.05,30.13 R18.1
N$24
  Top 0.381: R19.1 D11.0
N$25
  Top 0.381: D10.0 33.51,19.77 R20.1
N$26
  Top 0.254: U1.P$8 47.96,37.38 47.73,37.15 C5.1 46.52,36.88 FB2.1
N$27
  Top 0.381: J4.P$2 71.5,17.09 71.5,19.2 71.1,19.6 R36.0
N$28
  Top 0.381: J4.P$3 66.9,18.48 66.9,19.6 67.48,20.18 R37.0
N$29
  Top 0.381: R41.1 D21.0
N$30
  Top 0.381: R40.1 D22.0
N$31  (via drill 0.64)
  Top 0.381: D11.1 54.56,24.37 v54.56,25.8 | v44.3,39.22 44.22,39.14 D8.1 | v41.9,32.6 39.5,30.2 35.1,30.2 v31.7,26.8 31.7,23.6 35.37,19.93 D10.1 | v50.5,29.2 50.1,29.6 46.1,29.6 43.03,32.67 | 43.03,32.67 Q1.M | 41.7,32.42 41.88,32.6 v41.9,32.6 | v41.9,32.6 41.97,32.67 43.03,32.67 | D5.1 21.78,50.72 26.3,46.2 26.3,44.8 v26.1,44.6 25.9,44.4 25.9,43 26.3,42.6 26.3,33 v25.5,32.2 25.24,31.94 D9.1 20.32,33 16.3,33 16.1,32.8 15.1,32.8 12.7,30.4 12.7,26.4 9.7,23.4 9.7,23.2 8.3,21.8 8.3,20.4 8.63,20.07 D6.1 | D21.1 100.3,28.6 100.3,60.2 99.9,60.6 D22.1 98.73,60.97 86.3,60.97 | 86.3,60.97 D14.1 80.17,61.93 79.7,62.4 65.1,62.4 v63.9,61.2 | 86.3,60.97 86.3,46.9 D15.1 79.52,42.42 78.5,41.4 | D12.1 78.5,31.51 v78.5,35.4 | v78.5,39.4 78.5,41.4 | v67.9,42.6 69.1,41.4 78.5,41.4 | D13.1 62.94,40.8 v62.3,40.8 | D4.1 53.7,57.98 53.7,55 58.5,55 58.5,60 v59.7,61.2 | D7.1 29.6,44.6 v29.3,44.6
  Bottom 0.381: v41.9,32.6 44.3,35 v44.3,39.22 | v54.56,25.8 53.1,27.26 53.1,29 52.9,29.2 | 52.9,29.2 v50.5,29.2 | v31.7,26.8 31.7,30.6 30.1,32.2 v25.5,32.2 | v78.5,35.4 v78.5,39.4 | v67.9,42.6 64.1,42.6 v62.3,40.8 60.7,40.8 60.1,40.2 60.1,34.8 57.9,32.6 55.1,32.6 54.5,32 54.5,30.8 52.9,29.2 | v59.7,61.2 v63.9,61.2 | v26.1,44.6 v29.3,44.6
PIO1_2  (via drill 0.64)
  Top 0.254: U1.P$40 55.34,44.24 56.3,45.2 v56.3,47
  Top 0.381: v59.1,52.2 59.1,56 60.9,57.8 60.9,69.2 58.5,71.6 54.7,71.6 52.99,73.31 R12.P$2
  Bottom 0.381: v56.3,47 56.3,48.4 55.5,48.4 55.5,52.2 v59.1,52.2
PIO1_4
  Top 0.254: U1.P$35 60.28,40.38 61.1,41.2
  Top 0.381: 61.1,41.2 62.7,42.8 62.7,70.6 66.9,74.8 75.09,74.8 R13.P$2
Q1
  Top 0.381: Q1.L 45.32,32.83 R14.0
RESET  (via drill 0.64)
  Top 0.254: U1.P$3 48.02,39.88 46.9,41 46.7,41 | 46.7,41 46.02,41 R3.0 | 46.7,41 v46.7,42.4
  Top 0.381: J1.P$9 52.42,49.68 v52.5,49.46 | SW9.P$1 SW9.P$2 25.83,29.53 26.9,30.6 v26.9,43.6 | R3.0 46.01,41.09 45.1,42 41.5,42 39.9,43.6 v34.1,43.6
  Bottom 0.381: v52.5,49.46 49.96,49.46 46.7,46.2 v46.7,42.4 | v34.1,43.6 v26.9,43.6
RXD
  Top 0.254: U1.P$46 52.34,45.76 50.7,47.4 50.7,51.8 47.3,55.2 42.09,55.2 J3.P$2
SW1  (via drill 0.64)
  Top 0.254: U1.P$4 47.8,39.38 47.08,40.1 41.2,40.1 40.3,41 39.9,41 39.5,41.4
  Top 0.381: C8.1 SW1.P$1 SW1.P$2 | 39.5,41.4 39.3,41.6 33.5,41.6 30.3,38.4 v30.3,29.6
  Bottom 0.381: v30.3,29.6 30.3,26.4 27.01,23.11 SW1.P$2
SW2  (via drill 0.64)
  Top 0.254: U1.P$2 48.32,40.38 47.9,40.8 47.9,42.8 46.5,44.2
  Top 0.381: C15.1 10.55,45.67 SW2.P$1 SW2.P$2 | 46.5,44.2 45.02,45.68 40.72,45.68 39.2,47.2 35.9,47.2 35.38,46.68 33.66,46.68 32.78,45.8 v31.7,45.8
  Bottom 0.381: v31.7,45.8 27.7,45.8 27.57,45.67 SW2.P$2
SW3  (via drill 0.64)
  Top 0.254: U1.P$45 52.84,41.74 51.1,40 51.1,35 49,32.9 v49,31.8
  Top 0.381: C9.1 SW3.P$1 SW3.P$2
  Bottom 0.381: v49,31.8 49.01,31.71 SW3.P$2
SW4
  Top 0.254: U1.P$48 51.34,45.16 49.01,47.49 SW4.P$2
  Top 0.381: C14.1 35.9,50.77 SW4.P$1 SW4.P$2 | C14.1
SW5  (1 unrouted)
  Top 0.254: U1.P$38 56.34,36.36 57.5,35.2 57.5,33 58.17,32.33 SW5.P$1
  Top 0.381: C10.1 SW5.P$2
SW6  (1 unrouted)
  Top 0.254: U1.P$37 56.84,44.14 58.7,46
  Top 0.381: C13.1 73.02,54.87 SW6.P$2 | 58.7,46 59.3,46.6 59.3,50.6 60.51,51.81 SW6.P$1
SW7  (via drill 0.64)
  Top 0.254: U1.P$26 62.38,35.88 v63.5,37
  Top 0.381: SW7.P$2 SW7.P$1 C11.1 78.53,37 v72.7,37
  Bottom 0.381: v63.5,37 v72.7,37
SW8  (via drill 0.64)  (1 unrouted)
  Top 0.254: U1.P$27 60.68,36.38 v61.7,37.4
  Top 0.381: C12.1 SW8.P$1 84.51,53.21 83.3,52 79.5,52 75.5,48 71.3,48 66.1,42.8 v66.1,41.6
  Bottom 0.381: v61.7,37.4 v66.1,41.6
SWDCLK  (via drill 0.64)
  Top 0.254: 58.1,42.2 57.3,41.4 57.3,37.6 57.52,37.38 U1.P$29
  Top 0.381: J1.P$4 56.23,49.87 56.3,49.8 | 56.3,49.8 v56.7,49.4 | v60.1,46 60.1,44.2 58.1,42.2 | R2.0 55.8,49.8 56.3,49.8
  Bottom 0.381: v56.7,49.4 v60.1,46
SWDIO
  Top 0.254: U1.P$39 55.84,43.94 57.52,45.62 R1.0
  Top 0.381: R1.0 58.5,47.38 58.5,49 57.5,50 J1.P$2
TXD
  Top 0.254: J3.P$1 38.24,55.26 38.9,54.6 47.1,54.6 50.22,51.48 50.22,47.08 51.84,45.46 U1.P$47
VDD
  Top 1.016: J2.P$1 44.13,15.4 F1.P$1
XJOY
  Top 0.381: U$1.P$2 86.9,16.94 86.9,19.6 86.17,20.33 R23.1
XTALIN
  Top 0.203: 39.92,38.38 U1.P$6
  Top 0.254: 39.17,40.13 39.57,40.13 39.7,40 39.7,38.6 39.92,38.38
  Top 0.381: X1.P$2 37.36,40.1 C4.1 39.17,40.13
XTALOUT
  Top 0.203: U1.P$7 43.18,37.88 42.7,37.4
  Top 0.381: X1.P$1 36.48,35.02 36.63,34.87 C3.1 40.17,34.87 42.7,37.4
YJOY
  Top 0.381: R24.1 93.43,20.33 92.9,19.8 92.9,16.79 U$1.P$5
ZJOY
  Top 0.381: R25.1 U$1.P$8

### Text on the board
tPlace: POT2 | POT1 | SWD | R36-R39
bPlace: Usewood / CAN keypad driver / Left Rev 0.6 | CAN | IO | JOYSTICK